# Altium project MotorConnect.PrjPcb
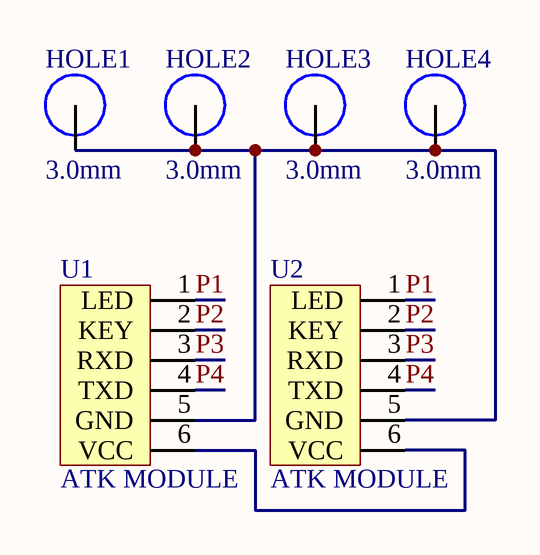
[diagram p0: MotorConnect.SchDoc]
1 sheet, 6 parts. Net scope: global (net labels, ports and power ports of the same name join across sheets).
Board files: MotorConnect.PcbDoc, BalanceLogo.PcbDoc, BalanceLogoBack.PcbDoc

## Sheet MotorConnect.SchDoc
size A4

### Parts
HOLE1  value 3.0mm  [HOLE-M3]  (hidden comment: HOLE)
HOLE2  value 3.0mm  [HOLE-M3]  (hidden comment: HOLE)
HOLE3  value 3.0mm  [HOLE-M3]  (hidden comment: HOLE)
HOLE4  value 3.0mm  [HOLE-M3]  (hidden comment: HOLE)
U1  ATK MODULE  [HDR2.54-M-LI-6P]
U2  ATK MODULE  [HDR2.54-M-LI-6P]

### Nets
P1: U1.1(LED) U2.1(LED)
P2: U1.2(KEY) U2.2(KEY)
P3: U1.3(RXD) U2.3(RXD)
P4: U1.4(TXD) U2.4(TXD)
NetHOLE1_1: HOLE1.1 HOLE2.1 HOLE3.1 HOLE4.1 U1.5(GND) U2.5(GND)
NetU1_6: U1.6(VCC) U2.6(VCC)

### Library data of the parts
U1 U2 = ATK-HC05